# Altium schematic sheet PowerSupply.SchDoc: =ProjectName
size 420 x 297 mm; Author: SBH; CompanyName: WUT; DrawnBy: SBH; Organization: ISE-WUT; Address1: Warsaw Univeristy of Technology; Address2: Nowowiejska 15/19; DocumentNumber: 3; Revision: -; SheetNumber: 3; SheetTotal: 12; EDA_Number: ARTIQ; Projet: eRTM15 Baikal; ModifiedBy: -; CreateDate: XX/XX/XXXX; CheckedDate: -; Title2: PowerSupply.SchDoc; DivGrp: ISE; Designer: SBH; ModifiedDate: -; ProjectName: eRTM15 Baikal
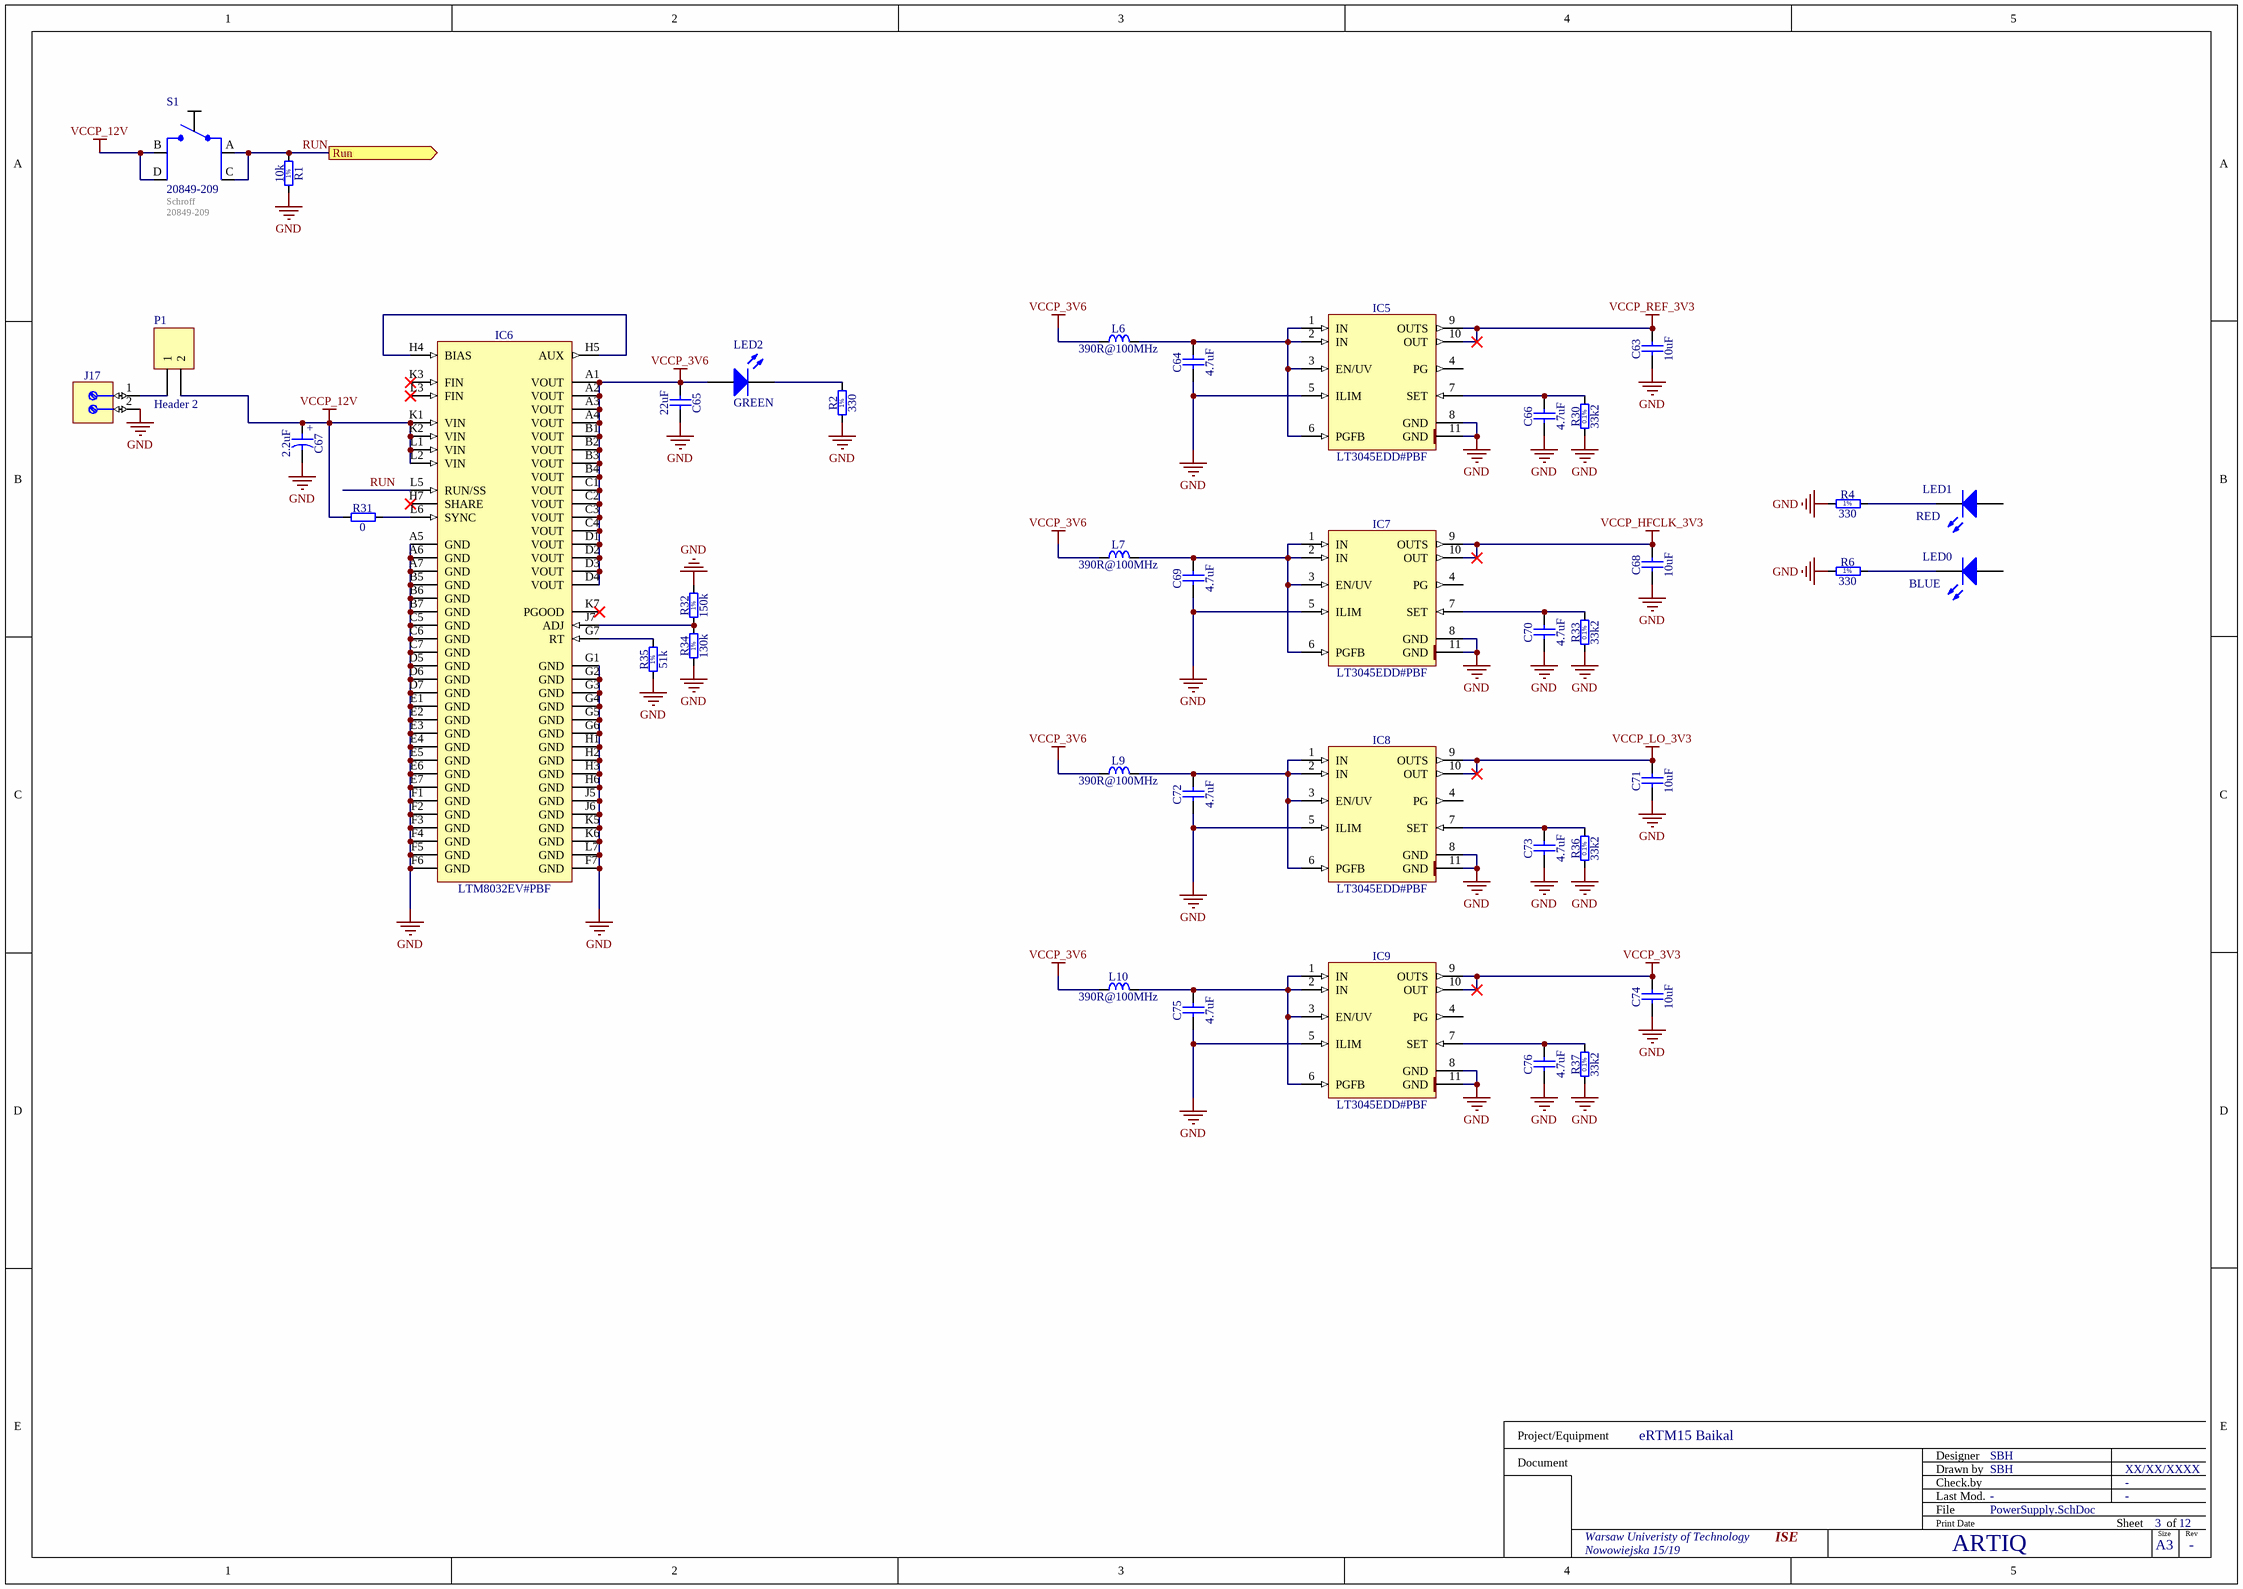
[diagram p0: PowerSupply.SchDoc]

## Parts
C63  10uF  [CAPC1608X87N]
C64  4.7uF  [CAPC1709X95N]
C65  22uF  [CAPC3216X180N]
C66  4.7uF  [CAPC1709X95N]
C67  2.2uF  [CAPMP3216X180N]
C68  10uF  [CAPC1608X87N]
C69  4.7uF  [CAPC1709X95N]
C70  4.7uF  [CAPC1709X95N]
C71  10uF  [CAPC1608X87N]
C72  4.7uF  [CAPC1709X95N]
C73  4.7uF  [CAPC1709X95N]
C74  10uF  [CAPC1608X87N]
C75  4.7uF  [CAPC1709X95N]
C76  4.7uF  [CAPC1709X95N]
IC5  LT3045EDD#PBF  [SON50P300X300X80-11N-R175X248]
IC6  LTM8032EV#PBF  [LGA71S127P7X11_900X1500X297]
IC7  LT3045EDD#PBF  [SON50P300X300X80-11N-R175X248]
IC8  LT3045EDD#PBF  [SON50P300X300X80-11N-R175X248]
IC9  LT3045EDD#PBF  [SON50P300X300X80-11N-R175X248]
J17  Terminal  [WIELAND_25.161.0253.0]  (value not drawn)
L6  390R@100MHz  [INDC1608X95N]
L7  390R@100MHz  [INDC1608X95N]
L9  390R@100MHz  [INDC1608X95N]
L10  390R@100MHz  [INDC1608X95N]
LED0  BLUE  [0603LED]
LED1  RED  [0603LED]
LED2  GREEN  [0603LED]
P1  Header 2  [HDR1X2]
R1  10k  [RESC1005X40N]
R2  330  [RESC1005X40N]
R4  330  [RESC1005X40N]
R6  330  [RESC1005X40N]
R30  33k2  [RESC1608X55N]
R31  0  [RESC1005X40N]
R32  150k  [RESC1005X40N]
R33  33k2  [RESC1608X55N]
R34  130k  [RESC1005X40N]
R35  51k  [RESC1005X40N]
R36  33k2  [RESC1608X55N]
R37  33k2  [RESC1608X55N]
S1  20849-209  Distributor: Schroff  [4-pin Switch]

## Ports
Run (out)

## Nets
GND: C63.1 C64.1 C65.2 C66.1 C67.2 C68.1 C69.1 C70.1 C71.1 C72.1 C73.1 C74.1 C75.1 C76.1 IC5.5(ILIM) IC5.8(GND) IC5.11(GND) IC6.A5(GND) IC6.A6(GND) IC6.A7(GND) IC6.B5(GND) IC6.B6(GND) IC6.B7(GND) IC6.C5(GND) IC6.C6(GND) IC6.C7(GND) IC6.D5(GND) IC6.D6(GND) IC6.D7(GND) IC6.E1(GND) IC6.E2(GND) IC6.E3(GND) IC6.E4(GND) IC6.E5(GND) IC6.E6(GND) IC6.E7(GND) IC6.F1(GND) IC6.F2(GND) IC6.F3(GND) IC6.F4(GND) IC6.F5(GND) IC6.F6(GND) IC6.F7(GND) IC6.G1(GND) IC6.G2(GND) IC6.G3(GND) IC6.G4(GND) IC6.G5(GND) IC6.G6(GND) IC6.H1(GND) IC6.H2(GND) IC6.H3(GND) IC6.H6(GND) IC6.J5(GND) IC6.J6(GND) IC6.K5(GND) IC6.K6(GND) IC6.L7(GND) IC7.5(ILIM) IC7.8(GND) IC7.11(GND) IC8.5(ILIM) IC8.8(GND) IC8.11(GND) IC9.5(ILIM) IC9.8(GND) IC9.11(GND) J17.2 R1.1 R2.1 R4.1 R6.1 R30.1 R32.2 R33.1 R34.1 R35.1 R36.1 R37.1
VCCP_3V3: C74.2 IC9.9(OUTS) IC9.10(OUT)
VCCP_3V6: C65.1 IC6.A1(VOUT) IC6.A2(VOUT) IC6.A3(VOUT) IC6.A4(VOUT) IC6.B1(VOUT) IC6.B2(VOUT) IC6.B3(VOUT) IC6.B4(VOUT) IC6.C1(VOUT) IC6.C2(VOUT) IC6.C3(VOUT) IC6.C4(VOUT) IC6.D1(VOUT) IC6.D2(VOUT) IC6.D3(VOUT) IC6.D4(VOUT) L6.1 L7.1 L9.1 L10.1 LED2.1(A)
VCCP_12V: C67.1 IC6.K1(VIN) IC6.K2(VIN) IC6.L1(VIN) IC6.L2(VIN) P1.2 R31.1 S1.B S1.D
VCCP_HFCLK_3V3: C68.2 IC7.9(OUTS) IC7.10(OUT)
VCCP_LO_3V3: C71.2 IC8.9(OUTS) IC8.10(OUT)
VCCP_REF_3V3: C63.2 IC5.9(OUTS) IC5.10(OUT)
RUN: IC6.L5(RUN/SS) R1.2 S1.A S1.C ; port Run
NetC64_2: C64.2 IC5.1(IN) IC5.2(IN) IC5.3(EN/UV) IC5.6(PGFB) L6.2
NetC66_2: C66.2 IC5.7(SET) R30.2
NetC69_2: C69.2 IC7.1(IN) IC7.2(IN) IC7.3(EN/UV) IC7.6(PGFB) L7.2
NetC70_2: C70.2 IC7.7(SET) R33.2
NetC72_2: C72.2 IC8.1(IN) IC8.2(IN) IC8.3(EN/UV) IC8.6(PGFB) L9.2
NetC73_2: C73.2 IC8.7(SET) R36.2
NetC75_2: C75.2 IC9.1(IN) IC9.2(IN) IC9.3(EN/UV) IC9.6(PGFB) L10.2
NetC76_2: C76.2 IC9.7(SET) R37.2
NetIC6_G7: IC6.G7(RT) R35.2
NetIC6_H4: IC6.H4(BIAS) IC6.H5(AUX)
NetIC6_J7: IC6.J7(ADJ) R32.1 R34.2
NetIC6_L6: IC6.L6(SYNC) R31.2
NetJ17_1: J17.1 P1.1
NetLED0_2: LED0.2(K) R6.2
NetLED1_2: LED1.2(K) R4.2
NetLED2_2: LED2.2(K) R2.2

Not connected (* = marked no-connect by the designer): IC5 4(PG); IC6 H7(SHARE)* K3(FIN)* K7(PGOOD)* L3(FIN)*; IC7 4(PG); IC8 4(PG); IC9 4(PG); LED0 1(A); LED1 1(A)

## Notes on the sheet
- Project/Equipment
- Document
- Designer
- Drawn by
- Check.by
- File
- Last Mod.
- Print Date
- Sheet
- Size
- A3
- of
- Rev
- (in symbol CTE3216-18_2.2UF_25V_10%) +
- (in symbol R0402_10K_1%_0.0625W_100PPM) 1%
- (in symbol R0402_51K_1%_0.0625W_100PPM) 1%
- (in symbol R0402_130K_1%_0.0625W_100PPM) 1%
- (in symbol R0402_150K_1%_0.0625W_100PPM) 1%
- (in symbol R0402_330R_1%_0.0625W_100PPM) 1%
- (in symbol R0603_33K2_0.1%_0.063W_10PPM) 0.1%

## Library data of the parts
C63 C68 C71 C74 = CC0603_10UF_6.3V_20%_X5R: Non-polarised capacitor; Part Description: SMD Multilayer Chip Ceramic Capacitor; Manufacturer: GENERIC; Manufacturer1 Part Number: C0603C106M9PAC; Voltage: 6.3V; TC: X5R; Tolerance: ±20%; Part Number: CC0603_10UF_6.3V_20%_X5R; Component Kind: Standard; Component Type: Standard; Pin Count: 2; Value: 10uF; Status: Preferred; Manufacturer Part Number: CC0603_10uF_6.3V_20%_X5R; Case: 0603; Mounted: Yes; Socket: No; SMD: Yes; Sense: No; Manufacturer1 Example: KEMET; Manufacturer1 ComponentHeight: 0.95mm; HelpURL: \\cern.ch\dfs\Applications\Altium\Datasheets\CC0603_X5R_KEMET.pdf; Author: CERN DEM JLC; CreateDate: 2007-12-03; LatestRevisionDate: 2007-12-03
C64 C66 C69 C70 C72 C73 C75 C76 = CC0603_4.7UF_16V_10%_X5R: Non-polarised capacitor; Part Description: SMD Multilayer Chip Ceramic Capacitor; Manufacturer: GENERIC; Manufacturer1 Part Number: EMK107ABJ475KA-T; Voltage: 16V; TC: X5R; Tolerance: ±10%; Part Number: CC0603_4.7UF_16V_10%_X5R; Component Kind: Standard; Component Type: Standard; Pin Count: 2; Value: 4.7uF; Status: None; Manufacturer Part Number: CC0603_4.7UF_16V_10%_X5R; Case: 0603; Mounted: Yes; Socket: No; SMD: Yes; Sense: No; Manufacturer1 Example: TAIYO YUDEN; Manufacturer1 ComponentHeight: 0.95mm; HelpURL: \\cern.ch\dfs\Applications\Altium\Datasheets\CC0603_X7R_TAIYO-YUDEN_HIGH-VALUE.pdf; Author: CERN DEM JLC; CreateDate: 2013-12-16; LatestRevisionDate: 2014-09-16
C65 = CC1206_22UF_10V_10%_X7R: Non-polarised capacitor; Part Description: SMD Multilayer Chip Ceramic Capacitor; Manufacturer: GENERIC; Manufacturer1 Part Number: GRM31CR71A226KE15L; Voltage: 10V; TC: X7R; Tolerance: ±10%; Part Number: CC1206_22UF_10V_10%_X7R; Component Kind: Standard; Component Type: Standard; Pin Count: 2; Value: 22uF; Status: Preferred; Manufacturer Part Number: CC1206_22UF_10V_10%_X7R; Case: 1206; Mounted: Yes; Socket: No; SMD: Yes; Sense: No; Manufacturer1 Example: MURATA; Manufacturer1 ComponentHeight: 1.8mm; HelpURL: \\cern.ch\dfs\Applications\Altium\Datasheets\CC1206_X7R_MURATA_GRM-HI-CAP.pdf; Author: CERN DEM JLC; CreateDate: 2010-06-08; LatestRevisionDate: 2010-06-08
C67 = CTE3216-18_2.2UF_25V_10%: Polarised capacitor; Part Description: Solid Tantalum Chip Capacitor; Manufacturer: GENERIC; Manufacturer1 Part Number: TAJA225K025R; Voltage: 25V; Tolerance: ±10%; Part Number: CTE3216-18_2.2UF_25V_10%; Component Kind: Standard; Component Type: Standard; Pin Count: 2; Value: 2.2uF; Status: Preferred; Manufacturer Part Number: CTE3216-18_2.2UF_25V_10%; Case: A; Mounted: Yes; Socket: No; SMD: Yes; Sense: No; Manufacturer1 Example: AVX; Manufacturer1 ComponentHeight: 1.8mm; HelpURL: \\cern.ch\dfs\Applications\Altium\Datasheets\CTE_AVX_TAJ.pdf; Author: CERN DEM JLC; CreateDate: 2008-05-26; LatestRevisionDate: 2008-05-26
IC5 IC7-IC9 = LT3045EDD#PBF: 20V, 500mA, Ultralow Noise, Ultrahigh PSRR Linear Regulator; Manufacturer: LINEAR TECHNOLOGY; PressFit: No; Bonding: No; Part Number: LT3045EDD#PBF; Component Kind: Standard; Component Type: Standard; Device: LT3045EDD#PBF; PackageDescription: SON, 0.50mm Pitch, 10-pin, 3.00mm W  X 3.00mm L X 0.80mm Height, (w/thermal tab 1.75 X 2.48 mm), IPC Medium Density; Part Description: 20V, 500mA, Ultralow Noise, Ultrahigh PSRR Linear Regulator; Manufacturer Part Number: LT3045EDD#PBF; Pin Count: 11; Case: SON10; Mounted: Yes; Socket: No; SMD: Yes; Sense: No; ComponentHeight: 0.8mm; HelpURL: \\cern.ch\dfs\Applications\Altium\Datasheets\LT3045EDD#PBF.pdf; Author: CERN DEM JLC; CreateDate: 2016-12-07; LatestRevisionDate: 2016-12-07
IC6 = LTM8032EV#PBF: 3V-36V To 0.8V-10V, Iout 2A Ultralow Noise EMC Compliant DC/DC uModule; Part Description: 3V-36V To 0.8V-10V, Iout 2A, Ultralow Noise EMC Compliant DC-DC uModule; Manufacturer: LINEAR TECHNOLOGY; PressFit: No; Bonding: No; Part Number: LTM8032EV#PBF; Component Kind: Standard; Component Type: Standard; Device: LTM8032EV#PBF; PackageDescription: LGA, 1.27mm pitch, rect., 71 pin, 7 columns X 11 rows, 9mm X 15mm X 2.97mm H; Manufacturer Part Number: LTM8032EV#PBF; Pin Count: 71; Case: LGA71; Mounted: Yes; Socket: No; SMD: Yes; Sense: No; ComponentHeight: 2.97mm; HelpURL: \\cern.ch\dfs\Applications\Altium\Datasheets\LTM8032EV#PBF.pdf; Author: CERN DEM JLC; CreateDate: 2009-06-17; LatestRevisionDate: 2011-12-07
J17 = WIELAND_25.161.0253.0: Terminal Block, 2 Positions, Screw Connection; Part Description: 16A 250VAC 2 Way PCB Terminal Block, Pitch 5mm, Screw Connection, Wire Size Max: 2.5mm²; PressFit: No; Part Number: WIELAND_25.161.0253.0; Component Kind: Standard; Component Type: Standard; Pin Count: 3; Family: Terminal; Mounted: Yes; Socket: No; SMD: No; Sense: No; Status: None; Manufacturer: WIELAND; Manufacturer Part Number: 25.161.0253.0; ComponentHeight: 15mm; HelpURL: \\cern.ch\dfs\Applications\Altium\Datasheets\WIELAND_25.161.0253.0.pdf; Author: CERN DEM JLC; CreateDate: 2009-06-03; LatestRevisionDate: 2009-06-03
L6 L7 L9 L10 = IND0603_TDK_MPZ1608R391A: Inductor; Part Description: SMT Chip Bead for Power Line; Manufacturer: TDK; Power: 1.2A; Resistance: 0.12R; Tolerance: ±25%; Part Number: IND0603_TDK_MPZ1608R391A; Component Kind: Standard; Component Type: Standard; Pin Count: 2; Value: 390R@100MHz; Status: None; Manufacturer Part Number: MPZ1608R391A; Case: 0603; Mounted: Yes; Socket: No; SMD: Yes; Sense: No; ComponentHeight: 0.95mm; HelpURL: \\cern.ch\dfs\Applications\Altium\Datasheets\IND0603_TDK_MPZ1608.pdf; Author: CERN DEM JLC; CreateDate: 2009-12-02; LatestRevisionDate: 2009-12-02
LED0 = LED2: LED; Type: SMT; Value: BLUE; Package: 0603
LED1 LED2 = LED3: LED; Type: SMT; Package: 0603
  LED1: Value: RED
  LED2: Value: GREEN
P1 = Header 2: Header, 2-Pin; LatestRevisionDate: 17-Jul-2002; LatestRevisionNote: Re-released for DXP Platform.; Publisher: Altium Limited
R1 = R0402_10K_1%_0.0625W_100PPM: Resistor - 1%; Part Description: General Purpose Thick Film Chip Resistor; Manufacturer: GENERIC; Manufacturer1 Part Number: 232270671003L; TC: ±100ppm/°C; Part Number: R0402_10K_1%_0.0625W_100PPM; Component Kind: Standard; Component Type: Standard; Pin Count: 2; Value: 10k; Status: Not recommended; Power: 0.0625W; Tolerance: ±1%; Manufacturer Part Number: R0402_10K_1%_0.0625W_100PPM; Case: 0402; Mounted: Yes; Sense: No; Socket: No; SMD: Yes; Manufacturer1 Example: YAGEO PHYCOMP; Manufacturer1 ComponentHeight: 0.4mm; HelpURL: \\cern.ch\dfs\Applications\Altium\Datasheets\R0402_Phycomp_RC0402.pdf; Author: CERN DEM JLC; CreateDate: 2007-12-03; LatestRevisionDate: 2012-10-17
R2 R4 R6 = R0402_330R_1%_0.0625W_100PPM: Resistor - 1%; Part Description: General Purpose Thick Film Chip Resistor; Manufacturer: GENERIC; Manufacturer1 Part Number: 232270673301L; TC: ±100ppm/°C; Part Number: R0402_330R_1%_0.0625W_100PPM; Component Kind: Standard; Component Type: Standard; Pin Count: 2; Value: 330; Status: Not recommended; Power: 0.0625W; Tolerance: ±1%; Manufacturer Part Number: R0402_330R_1%_0.0625W_100PPM; Case: 0402; Mounted: Yes; Sense: No; Socket: No; SMD: Yes; Manufacturer1 Example: YAGEO PHYCOMP; Manufacturer1 ComponentHeight: 0.4mm; HelpURL: \\cern.ch\dfs\Applications\Altium\Datasheets\R0402_Phycomp_RC0402.pdf; Author: CERN DEM JLC; CreateDate: 2007-12-03; LatestRevisionDate: 2012-10-17
R30 R33 R36 R37 = R0603_33K2_0.1%_0.063W_10PPM: Resistor - 0.1%; Part Description: Thin Film Chip Resistor; Manufacturer: GENERIC; Manufacturer1 Part Number: RN73C1J33K2BTDF; Power: 0.063W; TC: ±10ppm; Part Number: R0603_33K2_0.1%_0.063W_10PPM; Component Kind: Standard; Component Type: Standard; Pin Count: 2; Value: 33k2; Status: Not recommended; Tolerance: ±0.1%; Manufacturer Part Number: R0603_33K2_0.1%_0.063W_10PPM; Case: 0603; Mounted: Yes; Sense: No; Socket: No; SMD: Yes; Manufacturer1 Example: TYCO HOLSWORTHY; Manufacturer1 ComponentHeight: 0.5mm; HelpURL: \\cern.ch\dfs\Applications\Altium\Datasheets\R0603_Tyco_RN73.pdf; Author: CERN DEM JLC; CreateDate: 2007-12-03; LatestRevisionDate: 2008-03-13
R31 = R0402_0R_JUMPER: Resistor; Part Description: 1A (0.05R Max DC Resistance) Zero Ohm Jumper; Manufacturer: GENERIC; Manufacturer1 Part Number: 232270591001L; Part Number: R0402_0R_JUMPER; Component Kind: Standard; Component Type: Standard; Pin Count: 2; Value: 0; Status: Not recommended; Manufacturer Part Number: R0402_0R_JUMPER; Case: 0402; Mounted: Yes; Sense: No; Socket: No; SMD: Yes; Manufacturer1 Example: YAGEO PHYCOMP; Manufacturer1 ComponentHeight: 0.4mm; HelpURL: \\cern.ch\dfs\Applications\Altium\Datasheets\R0402_Phycomp_RC0402.pdf; Author: CERN DEM JLC; CreateDate: 2007-12-03; LatestRevisionDate: 2012-10-17
R32 = R0402_150K_1%_0.0625W_100PPM: Resistor - 1%; Part Description: General Purpose Thick Film Chip Resistor; Manufacturer: GENERIC; Manufacturer1 Part Number: 232270671504L; TC: ±100ppm/°C; Part Number: R0402_150K_1%_0.0625W_100PPM; Component Kind: Standard; Component Type: Standard; Pin Count: 2; Value: 150k; Status: Not recommended; Power: 0.0625W; Tolerance: ±1%; Manufacturer Part Number: R0402_150K_1%_0.0625W_100PPM; Case: 0402; Mounted: Yes; Sense: No; Socket: No; SMD: Yes; Manufacturer1 Example: YAGEO PHYCOMP; Manufacturer1 ComponentHeight: 0.4mm; HelpURL: \\cern.ch\dfs\Applications\Altium\Datasheets\R0402_Phycomp_RC0402.pdf; Author: CERN DEM JLC; CreateDate: 2007-12-03; LatestRevisionDate: 2012-10-17
R34 = R0402_130K_1%_0.0625W_100PPM: Resistor - 1%; Part Description: General Purpose Thick Film Chip Resistor; Manufacturer: GENERIC; Manufacturer1 Part Number: 232270671304L; TC: ±100ppm/°C; Part Number: R0402_130K_1%_0.0625W_100PPM; Component Kind: Standard; Component Type: Standard; Pin Count: 2; Value: 130k; Status: Not recommended; Power: 0.0625W; Tolerance: ±1%; Manufacturer Part Number: R0402_130K_1%_0.0625W_100PPM; Case: 0402; Mounted: Yes; Sense: No; Socket: No; SMD: Yes; Manufacturer1 Example: YAGEO PHYCOMP; Manufacturer1 ComponentHeight: 0.4mm; HelpURL: \\cern.ch\dfs\Applications\Altium\Datasheets\R0402_Phycomp_RC0402.pdf; Author: CERN DEM JLC; CreateDate: 2007-12-03; LatestRevisionDate: 2012-10-17
R35 = R0402_51K_1%_0.0625W_100PPM: Resistor - 1%; Part Description: General Purpose Thick Film Chip Resistor; Manufacturer: GENERIC; Manufacturer1 Part Number: 232270674703L; TC: ±100ppm/°C; Part Number: R0402_51K_1%_0.0625W_100PPM; Component Kind: Standard; Component Type: Standard; Pin Count: 2; Value: 51k; Status: Not recommended; Power: 0.0625W; Tolerance: ±1%; Manufacturer Part Number: R0402_51K_1%_0.0625W_100PPM; Case: 0402; Mounted: Yes; Sense: No; Socket: No; SMD: Yes; Manufacturer1 Example: YAGEO PHYCOMP; Manufacturer1 ComponentHeight: 0.4mm; HelpURL: \\cern.ch\dfs\Applications\Altium\Datasheets\R0402_Phycomp_RC0402.pdf; Author: CERN DEM JLC; CreateDate: 2007-12-03; LatestRevisionDate: 2012-10-17
S1 = 4-pin Switch: Mikroschalter fuer AMC-Modul (Schliesser); Manufacturer: Schroff; DistributorNr: 20849-209; ManufacturerNr: 20849-209; Type: SMT; Value: 20849-209; Package: 4-pin Switch